# EAGLE schematic untitled (EAGLE 7.5.0)
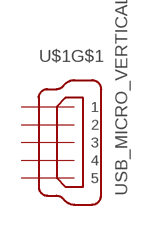
[diagram p0: schematic, sheet 1]

## Parts
U$1  USB_MICRO_VERTICAL  [USB_MICRO_VERTICAL]
Unconnected: U$1.1 U$1.2 U$1.3 U$1.4 U$1.5 U$1.P$1 U$1.P$2 U$1.P$3

## Library data of the parts
U$1 = 08_CONECTOR:USB_MICRO_VERTICAL